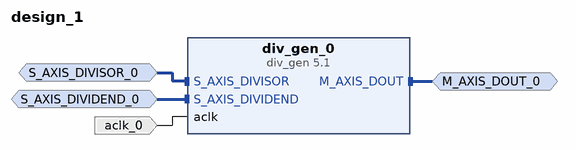
[diagram p0: block diagram of the top level]
# Vivado block design design_1, xc7a100tcsg324-1, Vivado 2019.1
create_bd_design design_1

create_bd_intf_port -mode Master -vlnv xilinx.com:interface:axis_rtl:1.0 M_AXIS_DOUT_0
set_property -dict {CONFIG.FREQ_HZ 1000000} [get_bd_intf_ports M_AXIS_DOUT_0]
create_bd_intf_port -mode Slave -vlnv xilinx.com:interface:axis_rtl:1.0 S_AXIS_DIVIDEND_0
set_property -dict [list \
  CONFIG.FREQ_HZ 1000000 \
  CONFIG.HAS_TKEEP 0 \
  CONFIG.HAS_TLAST 0 \
  CONFIG.HAS_TREADY 0 \
  CONFIG.HAS_TSTRB 0 \
  CONFIG.LAYERED_METADATA undef \
  CONFIG.TDATA_NUM_BYTES 2 \
  CONFIG.TDEST_WIDTH 0 \
  CONFIG.TID_WIDTH 0 \
  CONFIG.TUSER_WIDTH 0 \
] [get_bd_intf_ports S_AXIS_DIVIDEND_0]
create_bd_intf_port -mode Slave -vlnv xilinx.com:interface:axis_rtl:1.0 S_AXIS_DIVISOR_0
set_property -dict [list \
  CONFIG.FREQ_HZ 1000000 \
  CONFIG.HAS_TKEEP 0 \
  CONFIG.HAS_TLAST 0 \
  CONFIG.HAS_TREADY 0 \
  CONFIG.HAS_TSTRB 0 \
  CONFIG.LAYERED_METADATA undef \
  CONFIG.TDATA_NUM_BYTES 2 \
  CONFIG.TDEST_WIDTH 0 \
  CONFIG.TID_WIDTH 0 \
  CONFIG.TUSER_WIDTH 0 \
] [get_bd_intf_ports S_AXIS_DIVISOR_0]
create_bd_port -dir I -type clk aclk_0
set_property -dict {CONFIG.FREQ_HZ 1000000} [get_bd_ports aclk_0]

create_bd_cell -type ip -vlnv xilinx.com:ip:div_gen:5.1 div_gen_0
set_property -dict [list \
  CONFIG.algorithm_type Radix2 \
  CONFIG.dividend_and_quotient_width 16 \
  CONFIG.divisor_width 16 \
  CONFIG.fractional_width 16 \
  CONFIG.latency 20 \
  CONFIG.remainder_type Remainder \
] [get_bd_cells div_gen_0]

# ---- connections ----

connect_bd_intf_net -intf_net S_AXIS_DIVISOR_0_1 [get_bd_intf_ports S_AXIS_DIVISOR_0] [get_bd_intf_pins div_gen_0/S_AXIS_DIVISOR]
connect_bd_intf_net [get_bd_intf_ports M_AXIS_DOUT_0] [get_bd_intf_pins div_gen_0/M_AXIS_DOUT]
connect_bd_intf_net -intf_net S_AXIS_DIVIDEND_0_1 [get_bd_intf_ports S_AXIS_DIVIDEND_0] [get_bd_intf_pins div_gen_0/S_AXIS_DIVIDEND]
connect_bd_net -net aclk_0_1 [get_bd_ports aclk_0] [get_bd_pins div_gen_0/aclk]

validate_bd_design
save_bd_design
